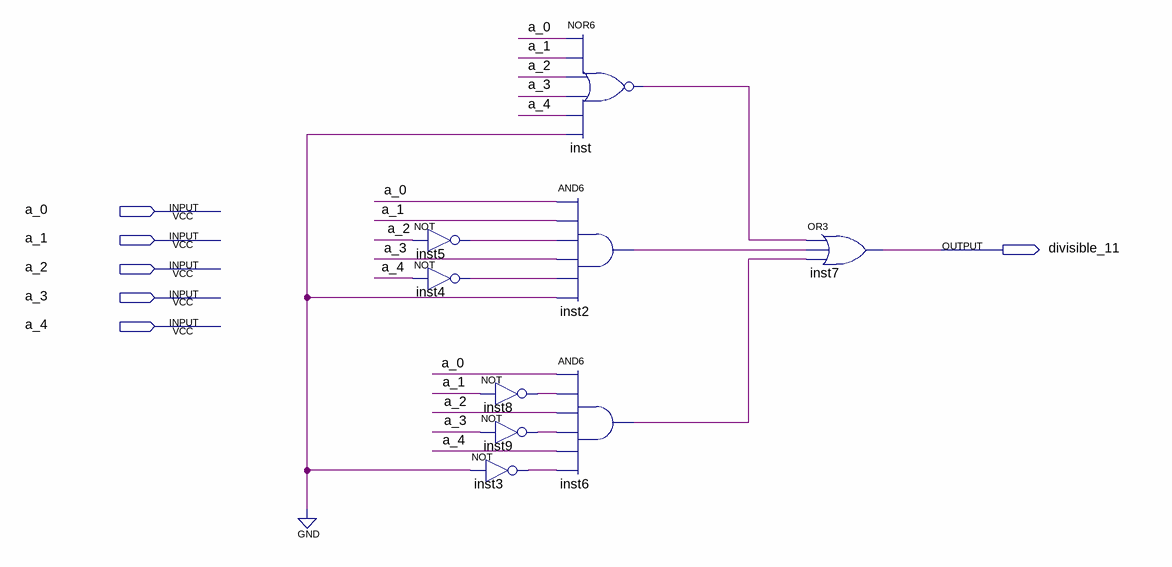
[diagram p0: schematic sheet]
// Quartus schematic Div_11.bdf as structural Verilog: 9 symbols, 6 pins
module Div_11 (
  input  a_0,
  input  a_1,
  input  a_2,
  input  a_3,
  input  a_4,
  output divisible_11
);

  wire inst2_out, inst3_out, inst4_out, inst5_out, inst6_out, inst8_out, inst9_out, inst_out;

  not inst5 (inst5_out, a_2);
  not inst4 (inst4_out, a_4);
  not inst8 (inst8_out, a_1);
  not inst9 (inst9_out, a_3);
  not inst3 (inst3_out, 1'b0);
  nor inst (inst_out, a_0, a_1, a_2, a_3, a_4, 1'b0);
  and inst2 (inst2_out, a_0, a_1, inst5_out, a_3, inst4_out, 1'b0);
  and inst6 (inst6_out, a_0, inst8_out, a_2, inst9_out, a_4, inst3_out);
  or inst7 (divisible_11, inst_out, inst2_out, inst6_out);
endmodule
